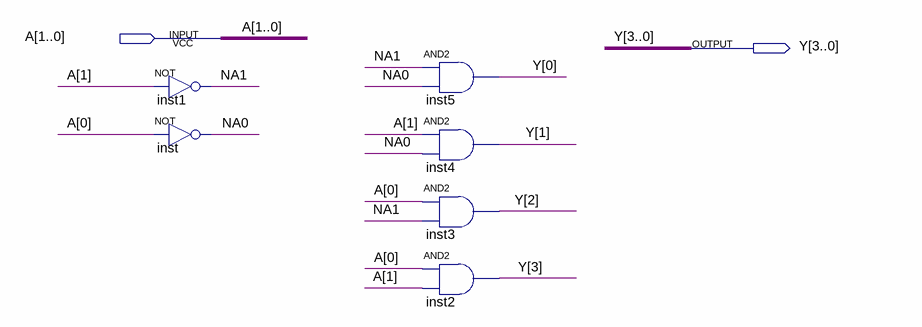
[diagram p0: schematic sheet]
// Quartus schematic Decoder2_4.bdf as structural Verilog: 6 symbols, 2 pins
module Decoder2_4 (
  input  [1:0] A,
  output [3:0] Y
);

  wire NA0, NA1;

  not inst1 (NA1, A[1]);
  not inst (NA0, A[0]);
  and inst5 (Y[0], NA1, NA0);
  and inst4 (Y[1], A[1], NA0);
  and inst3 (Y[2], A[0], NA1);
  and inst2 (Y[3], A[0], A[1]);
endmodule
